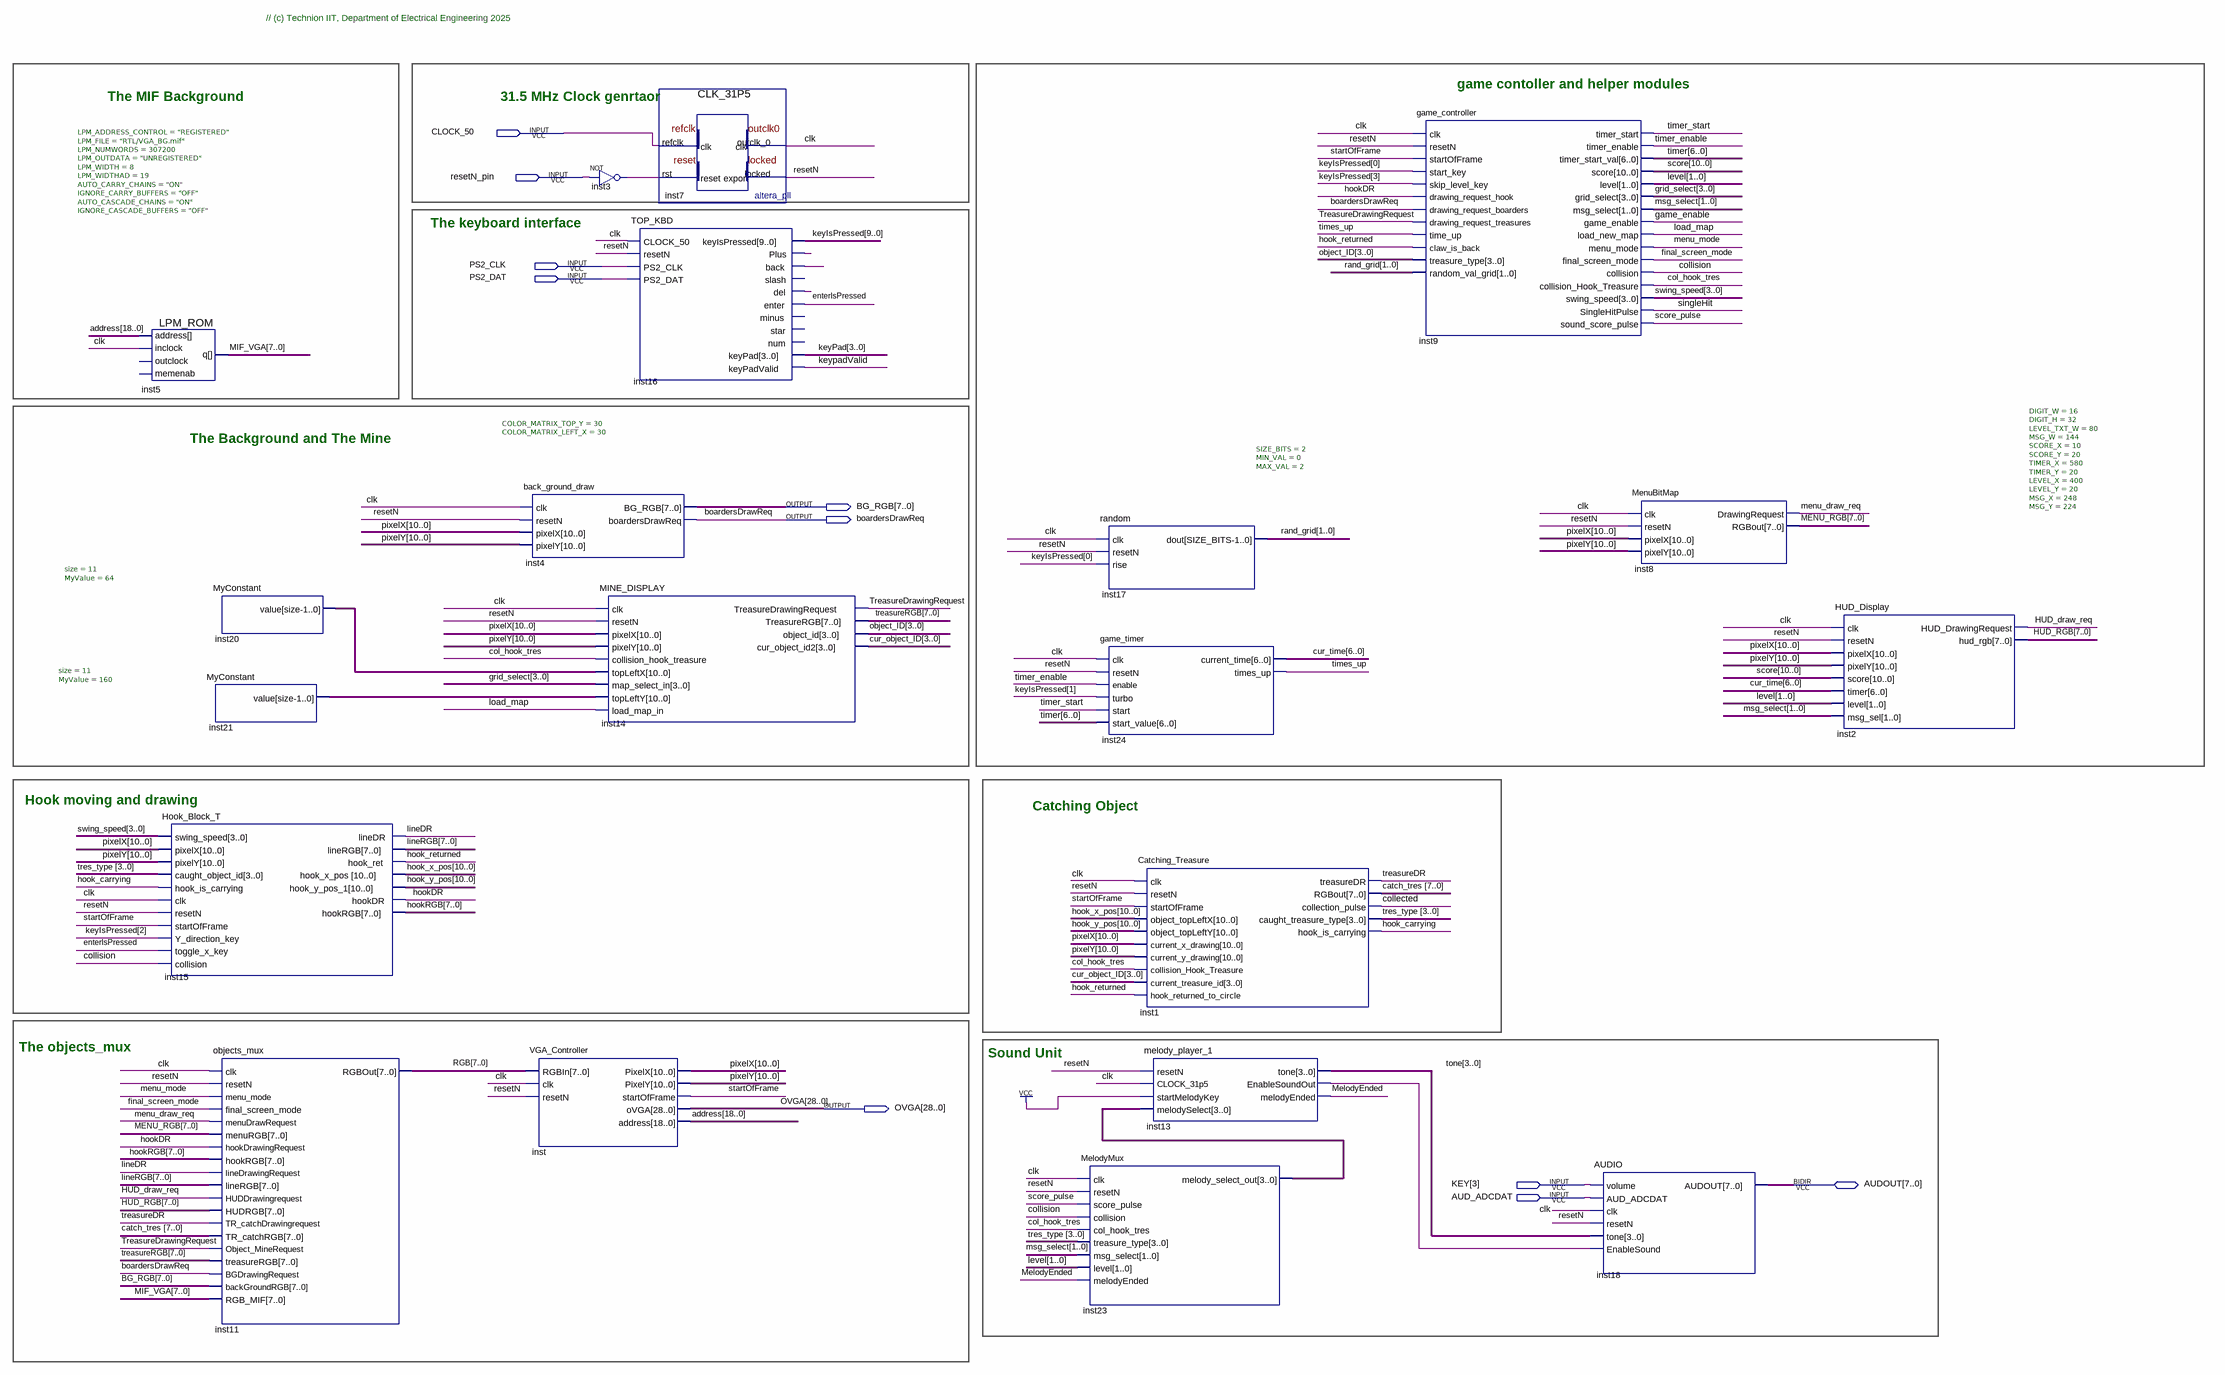
[diagram p0: schematic sheet]
// Quartus schematic TOP_VGA_DEMO_KBD.bdf as structural Verilog: 20 symbols, 10 pins
module TOP_VGA_DEMO_KBD (
  input  CLOCK_50,
  input  resetN_pin,
  input  PS2_CLK,
  input  PS2_DAT,
  input  [3:3] KEY,
  input  AUD_ADCDAT,
  inout  [7:0] AUDOUT,
  output [7:0] BG_RGB,
  output boardersDrawReq,
  output [28:0] OVGA
);

  wire clk, col_hook_tres, collected, collision, enterIsPressed, final_screen_mode, game_enable,
       hook_carrying, hook_returned, hookDR, HUD_draw_req, inst3_out, inst13_enablesoundout, inst16_back,
       inst16_del, inst16_plus, keypadValid, lineDR, load_map, MelodyEnded, menu_draw_req, menu_mode, resetN,
       score_pulse, singleHit, startOfFrame, timer_enable, timer_start, times_up, treasureDR,
       TreasureDrawingRequest;
  wire [1:0] level, msg_select, rand_grid;
  wire [3:0] cur_object_ID, grid_select, inst23_melody_select_out, keyPad, object_ID, swing_speed, tone,
       tres_type;
  wire [6:0] cur_time, timer;
  wire [7:0] catch_tres, hookRGB, HUD_RGB, lineRGB, MENU_RGB, MIF_VGA, RGB, treasureRGB;
  wire [9:0] keyIsPressed;
  wire [10:0] hook_x_pos, hook_y_pos, inst20_value, inst21_value, pixelX, pixelY, score;
  wire [18:0] address;

  LPM_ROM #(.LPM_ADDRESS_CONTROL("REGISTERED"), .LPM_FILE("RTL/VGA_BG.mif"), .LPM_NUMWORDS(307200), .LPM_OUTDATA("UNREGISTERED"), .LPM_WIDTH(8), .LPM_WIDTHAD(19), .AUTO_CARRY_CHAINS("ON"), .IGNORE_CARRY_BUFFERS("OFF"), .AUTO_CASCADE_CHAINS("ON"), .IGNORE_CASCADE_BUFFERS("OFF")) inst5 (
    .address(address), .inclock(clk), .q(MIF_VGA));  // open: outclock, memenab
  Hook_Block_T inst15 (
    .swing_speed(swing_speed), .pixelX(pixelX), .pixelY(pixelY), .caught_object_id(tres_type),
    .hook_is_carrying(hook_carrying), .clk(clk), .resetN(resetN), .startOfFrame(startOfFrame),
    .Y_direction_key(keyIsPressed[2]), .toggle_x_key(enterIsPressed), .collision(collision), .lineDR(lineDR),
    .lineRGB(lineRGB), .hook_ret(hook_returned), .hook_x_pos(hook_x_pos), .hook_y_pos_1(hook_y_pos),
    .hookDR(hookDR), .hookRGB(hookRGB));
  MyConstant #(.size(11), .MyValue(64)) inst20 (.value(inst20_value));
  MyConstant #(.size(11), .MyValue(160)) inst21 (.value(inst21_value));
  objects_mux inst11 (
    .clk(clk), .resetN(resetN), .menu_mode(menu_mode), .final_screen_mode(final_screen_mode),
    .menuDrawRequest(menu_draw_req), .menuRGB(MENU_RGB), .hookDrawingRequest(hookDR), .hookRGB(hookRGB),
    .lineDrawingRequest(lineDR), .lineRGB(lineRGB), .HUDDrawingrequest(HUD_draw_req), .HUDRGB(HUD_RGB),
    .TR_catchDrawingrequest(treasureDR), .TR_catchRGB(catch_tres),
    .Object_MineRequest(TreasureDrawingRequest), .treasureRGB(treasureRGB),
    .BGDrawingRequest(boardersDrawReq), .backGroundRGB(BG_RGB), .RGB_MIF(MIF_VGA), .RGBOut(RGB));
  back_ground_draw #(.COLOR_MATRIX_TOP_Y(30), .COLOR_MATRIX_LEFT_X(30)) inst4 (
    .clk(clk), .resetN(resetN), .pixelX(pixelX), .pixelY(pixelY), .BG_RGB(BG_RGB),
    .boardersDrawReq(boardersDrawReq));
  VGA_Controller inst (
    .RGBIn(RGB), .clk(clk), .resetN(resetN), .PixelX(pixelX), .PixelY(pixelY), .startOfFrame(startOfFrame),
    .oVGA(OVGA), .address(address));
  not inst3 (inst3_out, resetN_pin);
  TOP_KBD inst16 (
    .CLOCK_50(clk), .resetN(resetN), .PS2_CLK(PS2_CLK), .PS2_DAT(PS2_DAT), .keyIsPressed(keyIsPressed),
    .Plus(inst16_plus), .back(inst16_back), .del(inst16_del), .enter(enterIsPressed), .keyPad(keyPad),
    .keyPadValid(keypadValid));  // open: slash, minus, star, num
  MINE_DISPLAY inst14 (
    .clk(clk), .resetN(resetN), .pixelX(pixelX), .pixelY(pixelY), .collision_hook_treasure(col_hook_tres),
    .topLeftX(inst20_value), .map_select_in(grid_select), .topLeftY(inst21_value), .load_map_in(load_map),
    .TreasureDrawingRequest(TreasureDrawingRequest), .TreasureRGB(treasureRGB), .object_id(object_ID),
    .cur_object_id2(cur_object_ID));
  CLK_31P5 inst7 (.refclk(CLOCK_50), .rst(inst3_out), .outclk_0(clk), .locked(resetN));
  random #(.SIZE_BITS(2), .MIN_VAL(0), .MAX_VAL(2)) inst17 (
    .clk(clk), .resetN(resetN), .rise(keyIsPressed[0]), .dout(rand_grid));
  game_timer inst24 (
    .clk(clk), .resetN(resetN), .enable(timer_enable), .turbo(keyIsPressed[1]), .start(timer_start),
    .start_value(timer), .current_time(cur_time), .times_up(times_up));
  MelodyMux inst23 (
    .clk(clk), .resetN(resetN), .score_pulse(score_pulse), .collision(collision),
    .col_hook_tres(col_hook_tres), .treasure_type(tres_type), .msg_select(msg_select), .level(level),
    .melodyEnded(MelodyEnded), .melody_select_out(inst23_melody_select_out));
  Catching_Treasure inst1 (
    .clk(clk), .resetN(resetN), .startOfFrame(startOfFrame), .object_topLeftX(hook_x_pos),
    .object_topLeftY(hook_y_pos), .current_x_drawing(pixelX), .current_y_drawing(pixelY),
    .collision_Hook_Treasure(col_hook_tres), .current_treasure_id(cur_object_ID),
    .hook_returned_to_circle(hook_returned), .treasureDR(treasureDR), .RGBout(catch_tres),
    .collection_pulse(collected), .caught_treasure_type(tres_type), .hook_is_carrying(hook_carrying));
  melody_player_1 inst13 (
    .resetN(resetN), .CLOCK_31p5(clk), .startMelodyKey(1'b1), .melodySelect(inst23_melody_select_out),
    .tone(tone), .EnableSoundOut(inst13_enablesoundout), .melodyEnded(MelodyEnded));
  game_controller inst9 (
    .clk(clk), .resetN(resetN), .startOfFrame(startOfFrame), .start_key(keyIsPressed[0]),
    .skip_level_key(keyIsPressed[3]), .drawing_request_hook(hookDR),
    .drawing_request_boarders(boardersDrawReq), .drawing_request_treasures(TreasureDrawingRequest),
    .time_up(times_up), .claw_is_back(hook_returned), .treasure_type(object_ID), .random_val_grid(rand_grid),
    .timer_start(timer_start), .timer_enable(timer_enable), .timer_start_val(timer), .score(score),
    .level(level), .grid_select(grid_select), .msg_select(msg_select), .game_enable(game_enable),
    .load_new_map(load_map), .menu_mode(menu_mode), .final_screen_mode(final_screen_mode),
    .collision(collision), .collision_Hook_Treasure(col_hook_tres), .swing_speed(swing_speed),
    .SingleHitPulse(singleHit), .sound_score_pulse(score_pulse));
  AUDIO inst18 (
    .volume(KEY[3]), .AUD_ADCDAT(AUD_ADCDAT), .clk(clk), .resetN(resetN), .tone(tone),
    .EnableSound(inst13_enablesoundout), .AUDOUT(AUDOUT));
  MenuBitMap inst8 (
    .clk(clk), .resetN(resetN), .pixelX(pixelX), .pixelY(pixelY), .DrawingRequest(menu_draw_req),
    .RGBout(MENU_RGB));
  HUD_Display #(.DIGIT_W(16), .DIGIT_H(32), .LEVEL_TXT_W(80), .MSG_W(144), .SCORE_X(10), .SCORE_Y(20), .TIMER_X(580), .TIMER_Y(20), .LEVEL_X(400), .LEVEL_Y(20), .MSG_X(248), .MSG_Y(224)) inst2 (
    .clk(clk), .resetN(resetN), .pixelX(pixelX), .pixelY(pixelY), .score(score), .timer(cur_time),
    .level(level), .msg_sel(msg_select), .HUD_DrawingRequest(HUD_draw_req), .hud_rgb(HUD_RGB));

  // Notes on the sheet:
  //   // (c) Technion IIT, Department of Electrical Engineering 2025
  //   game contoller and helper modules
  //   The MIF Background
  //   31.5 MHz Clock genrtaor
  //   The keyboard interface
  //   The Background and The Mine
  //   Hook moving and drawing
  //   Catching Object 
  //   The objects_mux 
  //   Sound Unit
endmodule
